# EAGLE design csa_sid_v1.0b (EAGLE 6.4)

## Sheet 1 of 3
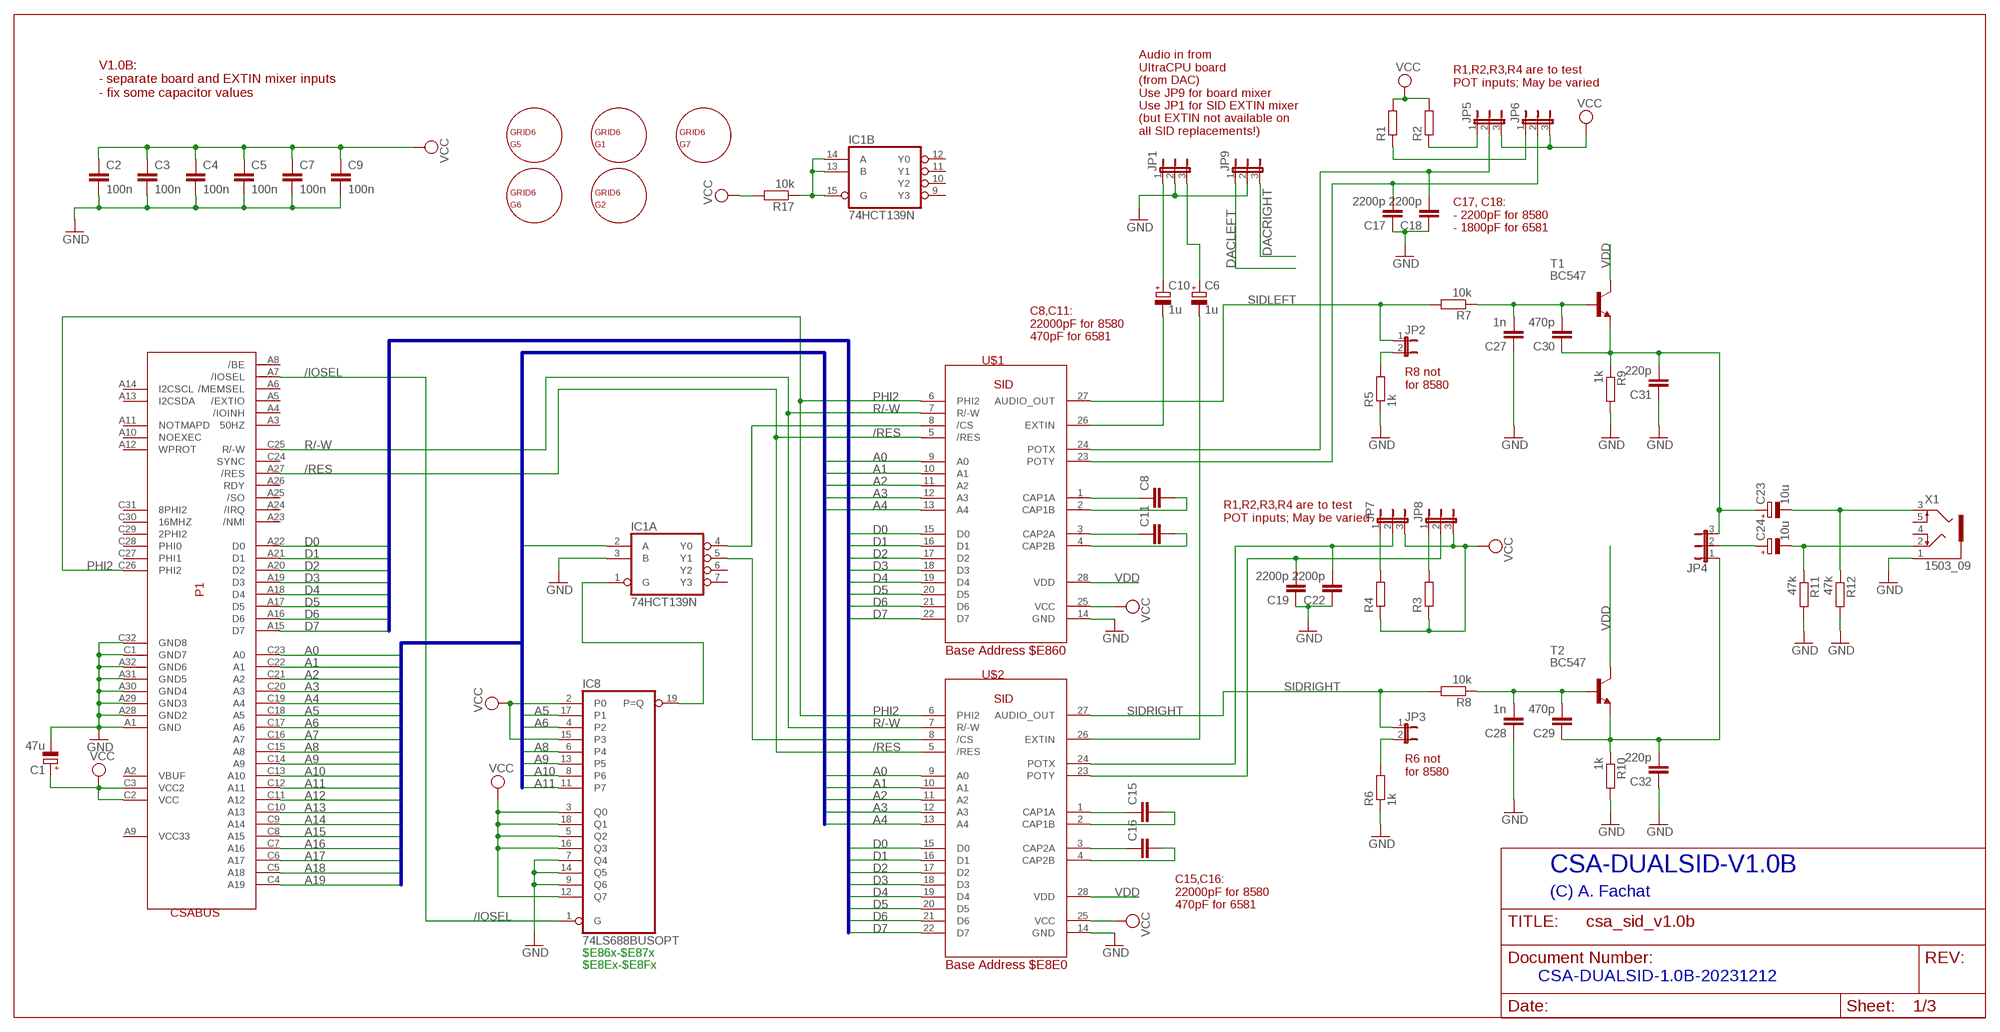
[diagram p0: schematic, sheet 1]

### Parts
C1  47u  CPOL-EUE2.5-7  [E2,5-7]
C2  100n  C-EU025-025X050  [C025-025X050]
C3  100n  C-EU025-025X050  [C025-025X050]
C4  100n  C-EU025-025X050  [C025-025X050]
C5  100n  C-EU025-025X050  [C025-025X050]
C6  1u  CPOL-EUE2-5  [E2-5]
C7  100n  C-EU025-025X050  [C025-025X050]
C8  C-EU025-025X050  [C025-025X050]
C9  100n  C-EU025-025X050  [C025-025X050]
C10  1u  CPOL-EUE2-5  [E2-5]
C11  C-EU025-025X050  [C025-025X050]
C15  C-EU025-025X050  [C025-025X050]
C16  C-EU025-025X050  [C025-025X050]
C17  2200p  C-EU025-025X050  [C025-025X050]
C18  2200p  C-EU025-025X050  [C025-025X050]
C19  2200p  C-EU025-025X050  [C025-025X050]
C22  2200p  C-EU025-025X050  [C025-025X050]
C23  10u  CPOL-EUE2-5  [E2-5]
C24  10u  CPOL-EUE2-5  [E2-5]
C27  1n  C-EU025-025X050  [C025-025X050]
C28  1n  C-EU025-025X050  [C025-025X050]
C29  470p  C-EU025-025X050  [C025-025X050]
C30  470p  C-EU025-025X050  [C025-025X050]
C31  220p  C-EU025-025X050  [C025-025X050]
C32  220p  C-EU025-025X050  [C025-025X050]
G1  GRID6  [GRID6]
G2  GRID6  [GRID6]
G5  GRID6  [GRID6]
G6  GRID6  [GRID6]
G7  GRID6  [GRID6]
IC1  74HCT139N  [DIL16]
IC8  74LS688BUSOPT  [DIL20]
JP1  JP2E  [JP2]
JP2  JP1E  [JP1]
JP3  JP1E  [JP1]
JP4  JP2E  [JP2]
JP5  JP2E  [JP2]
JP6  JP2E  [JP2]
JP7  JP2E  [JP2]
JP8  JP2E  [JP2]
JP9  JP2E  [JP2]
P1  CSABUS  [CSABUS]
R1  R-EU_0204/7  [0204/7]
R2  R-EU_0204/7  [0204/7]
R3  R-EU_0204/7  [0204/7]
R4  R-EU_0204/7  [0204/7]
R5  1k  R-EU_0204/7  [0204/7]
R6  1k  R-EU_0204/7  [0204/7]
R7  10k  R-EU_0204/7  [0204/7]
R8  10k  R-EU_0204/7  [0204/7]
R9  1k  R-EU_0204/7  [0204/7]
R10  1k  R-EU_0204/7  [0204/7]
R11  47k  R-EU_0204/7  [0204/7]
R12  47k  R-EU_0204/7  [0204/7]
R17  10k  R-EU_0204/7  [0204/7]
T1  BC547  [TO92]
T2  BC547  [TO92]
U$1  SID  [DIL28]
U$2  SID  [DIL28]
X1  1503_09  [1503_09]

### Nets
/IOSEL: IC8.1(G) P1.A7(/IOSEL)
/RES: P1.A27(/RES) U$1.5(/RES) U$2.5(/RES)
A0: P1.C23(A0) U$1.9(A0) U$2.9(A0)
A1: P1.C22(A1) U$1.10(A1) U$2.10(A1)
A2: P1.C21(A2) U$1.11(A2) U$2.11(A2)
A3: P1.C20(A3) U$1.12(A3) U$2.12(A3)
A4: P1.C19(A4) U$1.13(A4) U$2.13(A4)
A5: IC8.17(P1) P1.C18(A5)
A6: IC8.4(P2) P1.C17(A6)
A7: IC1.2(A:A) P1.C16(A7)
A8: IC8.6(P4) P1.C15(A8)
A9: IC8.13(P5) P1.C14(A9)
A10: IC8.8(P6) P1.C13(A10)
A11: IC8.11(P7) P1.C12(A11)
A12: P1.C11(A12)
A13: P1.C10(A13)
A14: P1.C9(A14)
A15: P1.C8(A15)
A16: P1.C7(A16)
A17: P1.C6(A17)
A18: P1.C5(A18)
A19: P1.C4(A19)
D0: P1.A22(D0) U$1.15(D0) U$2.15(D0)
D1: P1.A21(D1) U$1.16(D1) U$2.16(D1)
D2: P1.A20(D2) U$1.17(D2) U$2.17(D2)
D3: P1.A19(D3) U$1.18(D3) U$2.18(D3)
D4: P1.A18(D4) U$1.19(D4) U$2.19(D4)
D5: P1.A17(D5) U$1.20(D5) U$2.20(D5)
D6: P1.A16(D6) U$1.21(D6) U$2.21(D6)
D7: P1.A15(D7) U$1.22(D7) U$2.22(D7)
DACLEFT: JP9.1 ; also sheet 3
DACRIGHT: JP9.3 ; also sheet 3
GND: C1.- C2.2 C3.2 C4.2 C5.2 C7.2 C9.2 C17.1 C18.1 C19.1 C22.1 C27.1 C28.1 C31.1 C32.1 IC1.3(A:B) IC8.7(Q4) IC8.9(Q6) IC8.14(Q5) JP1.2 JP9.2 P1.A1(GND) P1.A28(GND2) P1.A29(GND3) P1.A30(GND4) P1.A31(GND5) P1.A32(GND6) P1.C1(GND7) P1.C32(GND8) R5.1 R6.1 R9.2 R10.2 R11.2 R12.2 U$1.14(GND) U$2.14(GND) X1.1 ; also sheet 2,3
N$1: IC1.1(A:G) IC8.19(P=Q)
N$2: IC1.4(A:Y0) U$1.8(/CS)
N$3: IC1.5(A:Y1) U$2.8(/CS)
N$4: C8.1 U$1.1(CAP1A)
N$5: C11.1 U$1.3(CAP2A)
N$6: C8.2 U$1.2(CAP1B)
N$7: C11.2 U$1.4(CAP2B)
N$8: C15.1 U$2.1(CAP1A)
N$9: C16.1 U$2.3(CAP2A)
N$10: C15.2 U$2.2(CAP1B)
N$11: C16.2 U$2.4(CAP2B)
N$12: C17.2 JP6.2 U$1.23(POTY)
N$13: C18.2 JP5.2 U$1.24(POTX)
N$14: C19.2 JP8.2 U$2.23(POTY)
N$15: C22.2 JP7.2 U$2.24(POTX)
N$16: C10.- U$1.26(EXTIN)
N$17: JP5.1 R2.1
N$18: JP6.1 R1.1
N$19: JP3.2 R6.2
N$20: JP2.2 R5.2
N$21: C6.- U$2.26(EXTIN)
N$22: C23.- R12.1 X1.3
N$23: C24.- R11.1 X1.2
N$24: C29.1 C32.2 JP4.1 R10.1 T2.1(E)
N$25: C23.+ C30.1 C31.2 JP4.3 R9.1 T1.1(E)
N$26: C27.2 C30.2 R7.1 T1.2(B)
N$28: C28.2 C29.2 R8.1 T2.2(B)
N$30: C24.+ JP4.2
N$35: IC1.13(B:B) IC1.14(B:A) IC1.15(B:G) R17.1
N$36: JP7.1 R4.2
N$37: JP8.1 R3.2
N$38: C6.+ JP1.3
N$39: C10.+ JP1.1
PHI2: P1.C26(PHI2) U$1.6(PHI2) U$2.6(PHI2)
R/-W: P1.C25(R/-W) U$1.7(R/-W) U$2.7(R/-W)
SIDLEFT: JP2.1 R7.2 U$1.27(AUDIO_OUT) ; also sheet 3
SIDRIGHT: JP3.1 R8.2 U$2.27(AUDIO_OUT) ; also sheet 3
VCC: C1.+ C2.1 C3.1 C4.1 C5.1 C7.1 C9.1 IC8.2(P0) IC8.3(Q0) IC8.5(Q2) IC8.12(Q7) IC8.15(P3) IC8.16(Q3) IC8.18(Q1) JP5.3 JP6.3 JP7.3 JP8.3 P1.C2(VCC) P1.C3(VCC2) R1.2 R2.2 R3.1 R4.1 R17.2 U$1.25(VCC) U$2.25(VCC) ; also sheet 2,3
VDD: T1.3(C) T2.3(C) U$1.28(VDD) U$2.28(VDD) ; also sheet 2
Unconnected: IC1.6(A:Y2) IC1.7(A:Y3) IC1.9(B:Y3) IC1.10(B:Y2) IC1.11(B:Y1) IC1.12(B:Y0) P1.A2(VBUF) P1.A3(50HZ) P1.A4(/IOINH) P1.A5(/EXTIO) P1.A6(/MEMSEL) P1.A8(/BE) P1.A9(VCC33) P1.A10(NOEXEC) P1.A11(NOTMAPD) P1.A12(WPROT) P1.A13(I2CSDA) P1.A14(I2CSCL) P1.A23(/NMI) P1.A24(/IRQ) P1.A25(/SO) P1.A26(RDY) P1.C24(SYNC) P1.C27(PHI1) P1.C28(PHI0) P1.C29(2PHI2) P1.C30(16MHZ) P1.C31(8PHI2) X1.4 X1.5

### Buses
D[0..7]
A[0..19]

### Notes on the sheet
- R1,R2,R3,R4 are to test
  POT inputs; May be varied
- V1.0B:
  - separate board and EXTIN mixer inputs
  - fix some capacitor values
- Audio in from
  UltraCPU board
  (from DAC)
  Use JP9 for board mixer
  Use JP1 for SID EXTIN mixer
  (but EXTIN not available on
  all SID replacements!)
- C17, C18:
  - 2200pF for 8580
  - 1800pF for 6581
- C8,C11: 
  22000pF for 8580
  470pF for 6581
- R8 not 
  for 8580
- R1,R2,R3,R4 are to test
  POT inputs; May be varied
- Base Address $E860
- R6 not
  for 8580
- CSA-DUALSID-V1.0B
- (C) A. Fachat
- C15,C16: 
  22000pF for 8580
  470pF for 6581
- $E86x-$E87x
- $E8Ex-$E8Fx | Base Address $E8E0
- CSA-DUALSID-1.0B-20231212

## Sheet 2 of 3: Power
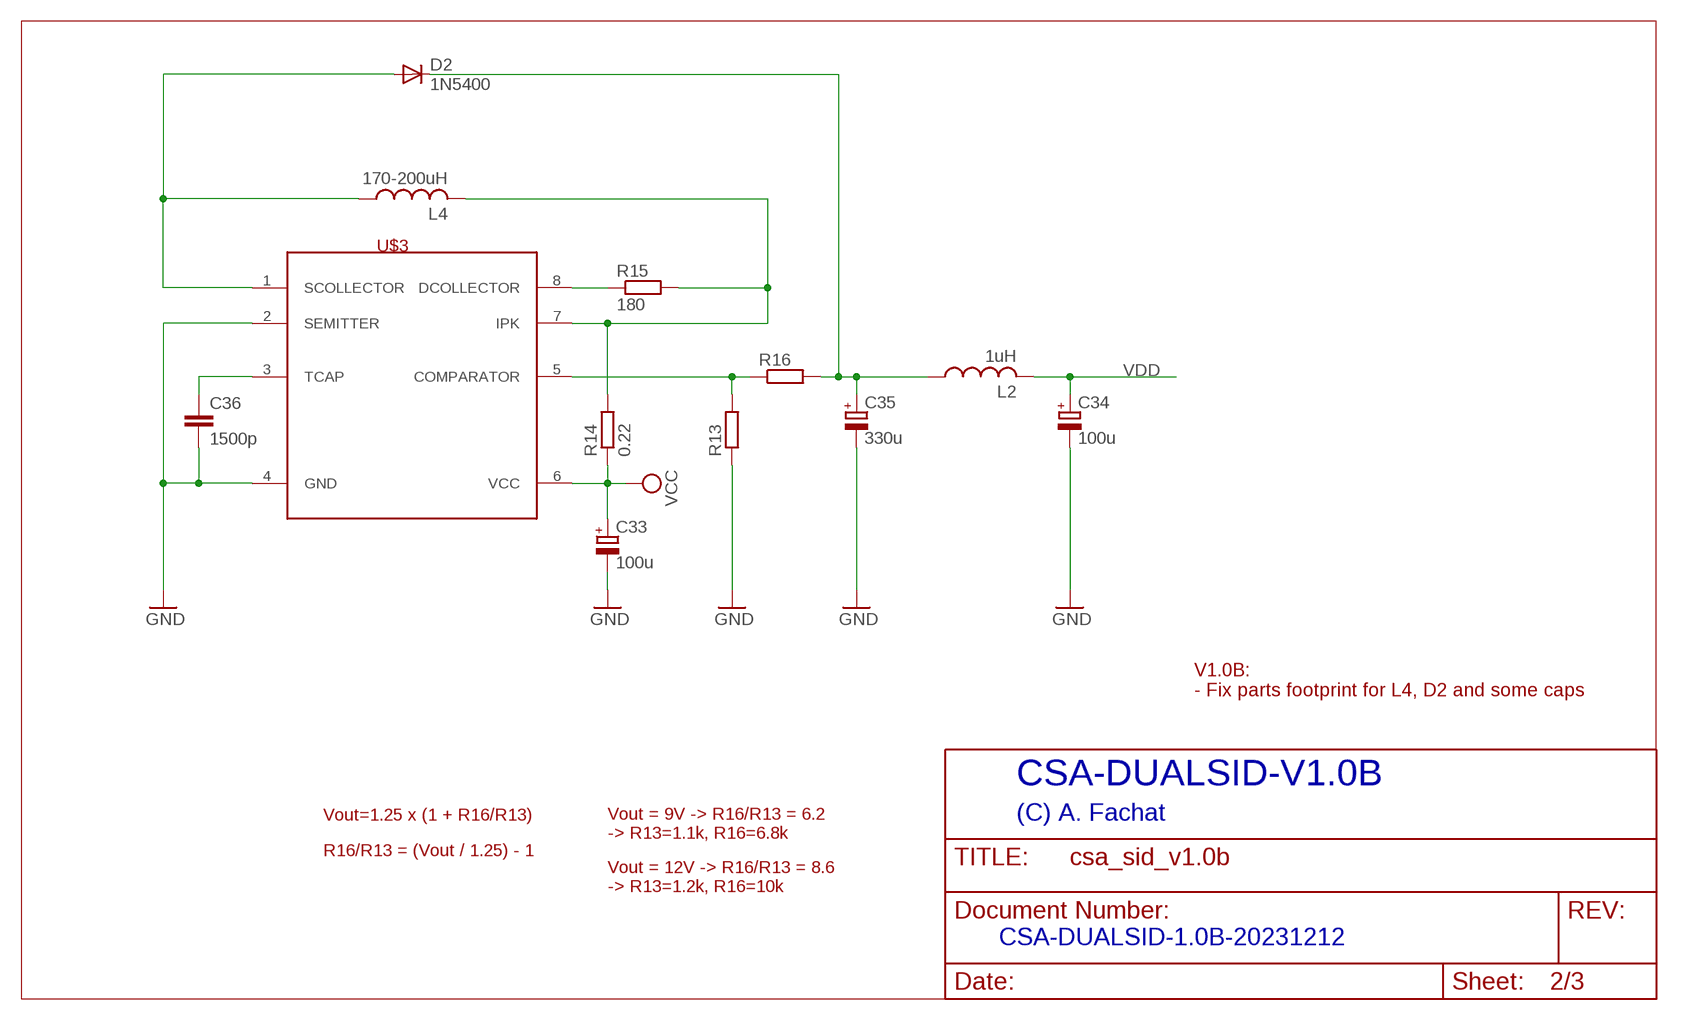
[diagram p1: schematic, sheet 2]

### Parts
C33  100u  CPOL-EUE2.5-7  [E2,5-7]
C34  100u  CPOL-EUE2.5-7  [E2,5-7]
C35  330u  CPOL-EUE2.5-7  [E2,5-7]
C36  1500p  C-EU025-024X044  [C025-024X044]
D2  1N5400  [DO201-15]
L2  1uH  L-US0204/7  [0204/7]
L4  170-200uH  L-USTJ4-U2  [TJ4-U2]
R13  R-EU_0204/7  [0204/7]
R14  0.22  R-EU_0204/7  [0204/7]
R15  180  R-EU_0204/7  [0204/7]
R16  R-EU_0204/7  [0204/7]
U$3  MC34063A  [DIL08]

### Nets
GND: C33.- C34.- C35.- C36.2 R13.1 U$3.2(SEMITTER) U$3.4(GND) ; also sheet 1,3
N$27: C36.1 U$3.3(TCAP)
N$29: R13.2 R16.1 U$3.5(COMPARATOR)
N$31: D2.A L4.1 U$3.1(SCOLLECTOR)
N$32: C35.+ D2.C L2.1 R16.2
N$33: L4.2 R14.2 R15.2 U$3.7(IPK)
N$34: R15.1 U$3.8(DCOLLECTOR)
VCC: C33.+ R14.1 U$3.6(VCC) ; also sheet 1,3
VDD: C34.+ L2.2 ; also sheet 1

### Notes on the sheet
- V1.0B:
  - Fix parts footprint for L4, D2 and some caps
- CSA-DUALSID-V1.0B
- Vout=1.25 x (1 + R16/R13) | (C) A. Fachat
- Vout = 9V -> R16/R13 = 6.2
  -> R13=1.1k, R16=6.8k
- R16/R13 = (Vout / 1.25) - 1
- Vout = 12V -> R16/R13 = 8.6
  -> R13=1.2k, R16=10k
- CSA-DUALSID-1.0B-20231212

## Sheet 3 of 3: Mixer
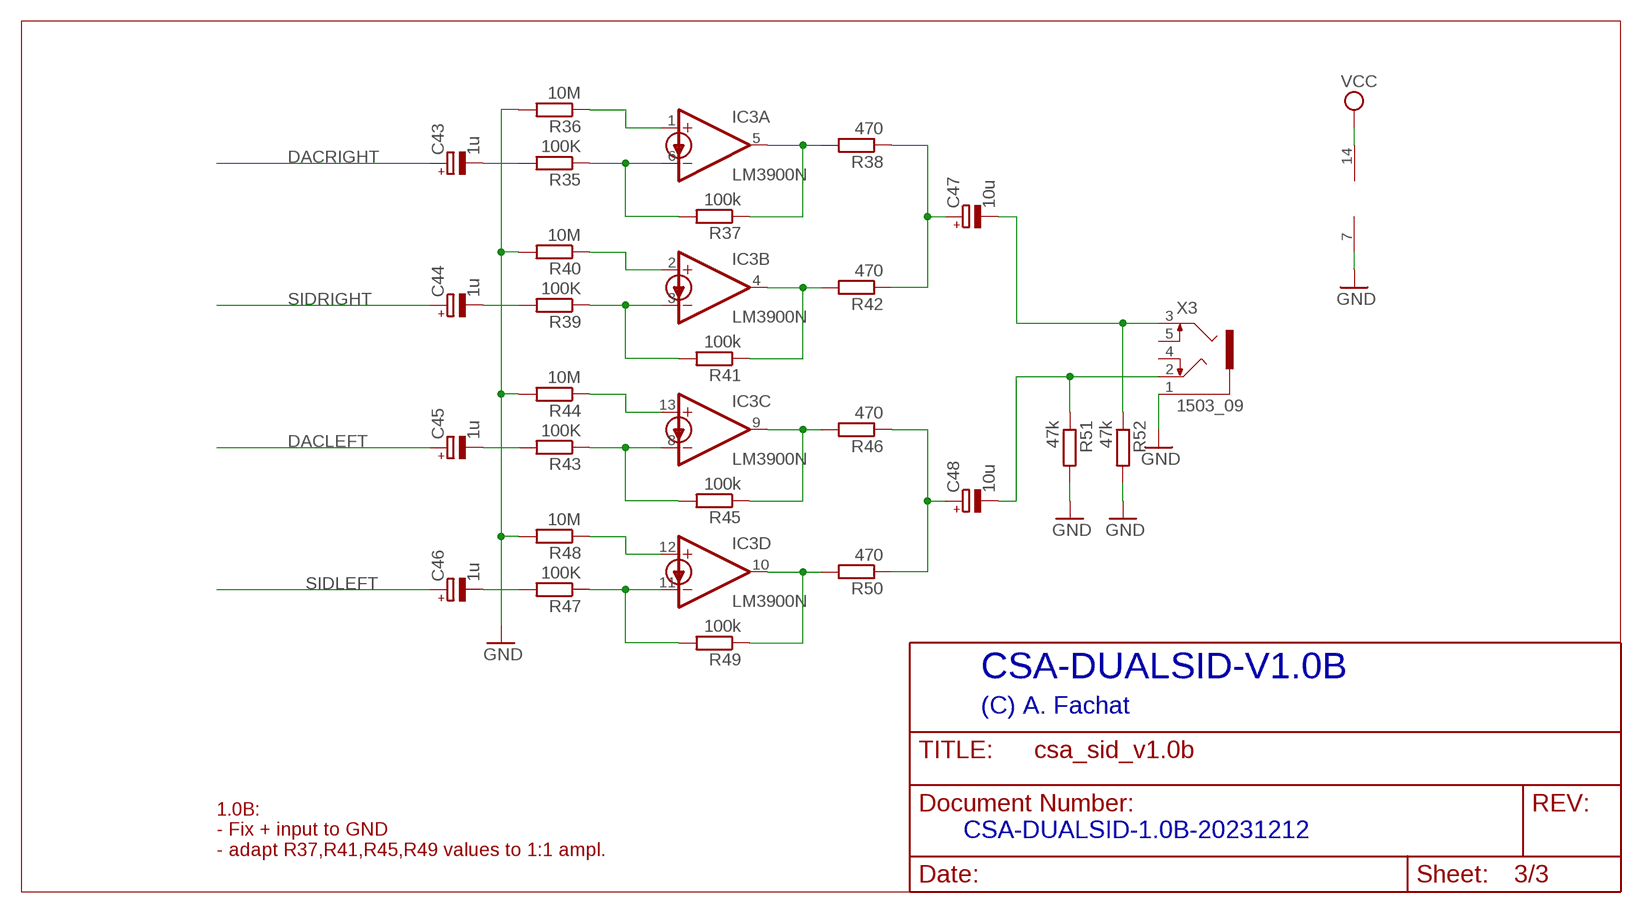
[diagram p2: schematic, sheet 3]

### Parts
C43  1u  CPOL-EUE2-5  [E2-5]
C44  1u  CPOL-EUE2-5  [E2-5]
C45  1u  CPOL-EUE2-5  [E2-5]
C46  1u  CPOL-EUE2-5  [E2-5]
C47  10u  CPOL-EUE2-5  [E2-5]
C48  10u  CPOL-EUE2-5  [E2-5]
IC3  LM3900N  [DIL14]
R35  100K  R-EU_0204/7  [0204/7]
R36  10M  R-EU_0204/7  [0204/7]
R37  100k  R-EU_0204/7  [0204/7]
R38  470  R-EU_0204/7  [0204/7]
R39  100K  R-EU_0204/7  [0204/7]
R40  10M  R-EU_0204/7  [0204/7]
R41  100k  R-EU_0204/7  [0204/7]
R42  470  R-EU_0204/7  [0204/7]
R43  100K  R-EU_0204/7  [0204/7]
R44  10M  R-EU_0204/7  [0204/7]
R45  100k  R-EU_0204/7  [0204/7]
R46  470  R-EU_0204/7  [0204/7]
R47  100K  R-EU_0204/7  [0204/7]
R48  10M  R-EU_0204/7  [0204/7]
R49  100k  R-EU_0204/7  [0204/7]
R50  470  R-EU_0204/7  [0204/7]
R51  47k  R-EU_0204/7  [0204/7]
R52  47k  R-EU_0204/7  [0204/7]
X3  1503_09  [1503_09]

### Nets
DACLEFT: C45.+ ; also sheet 1
DACRIGHT: C43.+ ; also sheet 1
GND: IC3.7(P:GND) R36.2 R40.2 R44.2 R48.2 R51.2 R52.2 X3.1 ; also sheet 1,2
N$57: IC3.1(A:+IN) R36.1
N$58: C43.- R35.2
N$59: IC3.6(A:-IN) R35.1 R37.2
N$60: IC3.5(A:OUT) R37.1 R38.2
N$61: IC3.2(B:+IN) R40.1
N$62: C44.- R39.2
N$63: IC3.3(B:-IN) R39.1 R41.2
N$64: IC3.4(B:OUT) R41.1 R42.2
N$65: IC3.13(C:+IN) R44.1
N$66: C45.- R43.2
N$67: IC3.8(C:-IN) R43.1 R45.2
N$68: IC3.9(C:OUT) R45.1 R46.2
N$69: IC3.12(D:+IN) R48.1
N$70: C46.- R47.2
N$71: IC3.11(D:-IN) R47.1 R49.2
N$72: IC3.10(D:OUT) R49.1 R50.2
N$73: C47.+ R38.1 R42.1
N$74: C47.- R52.1 X3.3
N$75: C48.+ R46.1 R50.1
N$76: C48.- R51.1 X3.2
SIDLEFT: C46.+ ; also sheet 1
SIDRIGHT: C44.+ ; also sheet 1
VCC: IC3.14(P:V+) ; also sheet 1,2
Unconnected: X3.4 X3.5

### Notes on the sheet
- CSA-DUALSID-V1.0B
- (C) A. Fachat
- CSA-DUALSID-1.0B-20231212
- 1.0B:
  - Fix + input to GND
  - adapt R37,R41,R45,R49 values to 1:1 ampl.

## Power pins joined to a net without a drawn wire
GND: IC1.8(P:GND) IC8.10(GND)
VCC: IC1.16(P:VCC) IC8.20(VCC)

## Library data of the parts
C1 C6 C10 C23 C24 C33-C35 C43-C48 = rcl:CPOL-EU: POLARIZED CAPACITOR, European symbol
C2-C5 C7-C9 C11 C15-C19 C22 C27-C32 C36 = rcl:C-EU: CAPACITOR, European symbol
D2 = diode:1N5400: DIODE standard rectifier, 3 A, 50 V (Motorola)
G1 G2 G5-G7 = csa:GRID
IC1 = 74xx-eu:74*139: Dual 2-line to 4-line DECODER/DEMULTIPLEXER
IC3 = linear:LM3900: OP AMP
IC8 = csa:74LS688BUSOPT
JP1 JP4-JP9 = jumper:JP2E: JUMPER
JP2 JP3 = jumper:JP1E: JUMPER
L2 L4 = rcl:L-US: INDUCTOR, American symbol
P1 = csa:CSABUS
R1-R17 R35-R52 = rcl:R-EU_: RESISTOR, European symbol
T1 T2 = transistor:BC547: NPN TRANSISTOR
U$1 U$2 = csa:SID
U$3 = csa:MC34063A
X1 X3 = con-lumberg:1503_09: Jack connectors according to JISC 6560, 3.5 mm Klinkeneinbaukupplung nach JISC 6560, 3,5 mm, 3-polig/ stereo, abgewinkelte Ausführung, mit 2 Öffnern und Lötaugen, für Leiterplatten Rückseitenmontage Source: http://www.lumberg.com/Produkte/PDFs/1503_09.pdf; OC_FARNELL: 1243244; OC_NEWARK: unknown

## Board
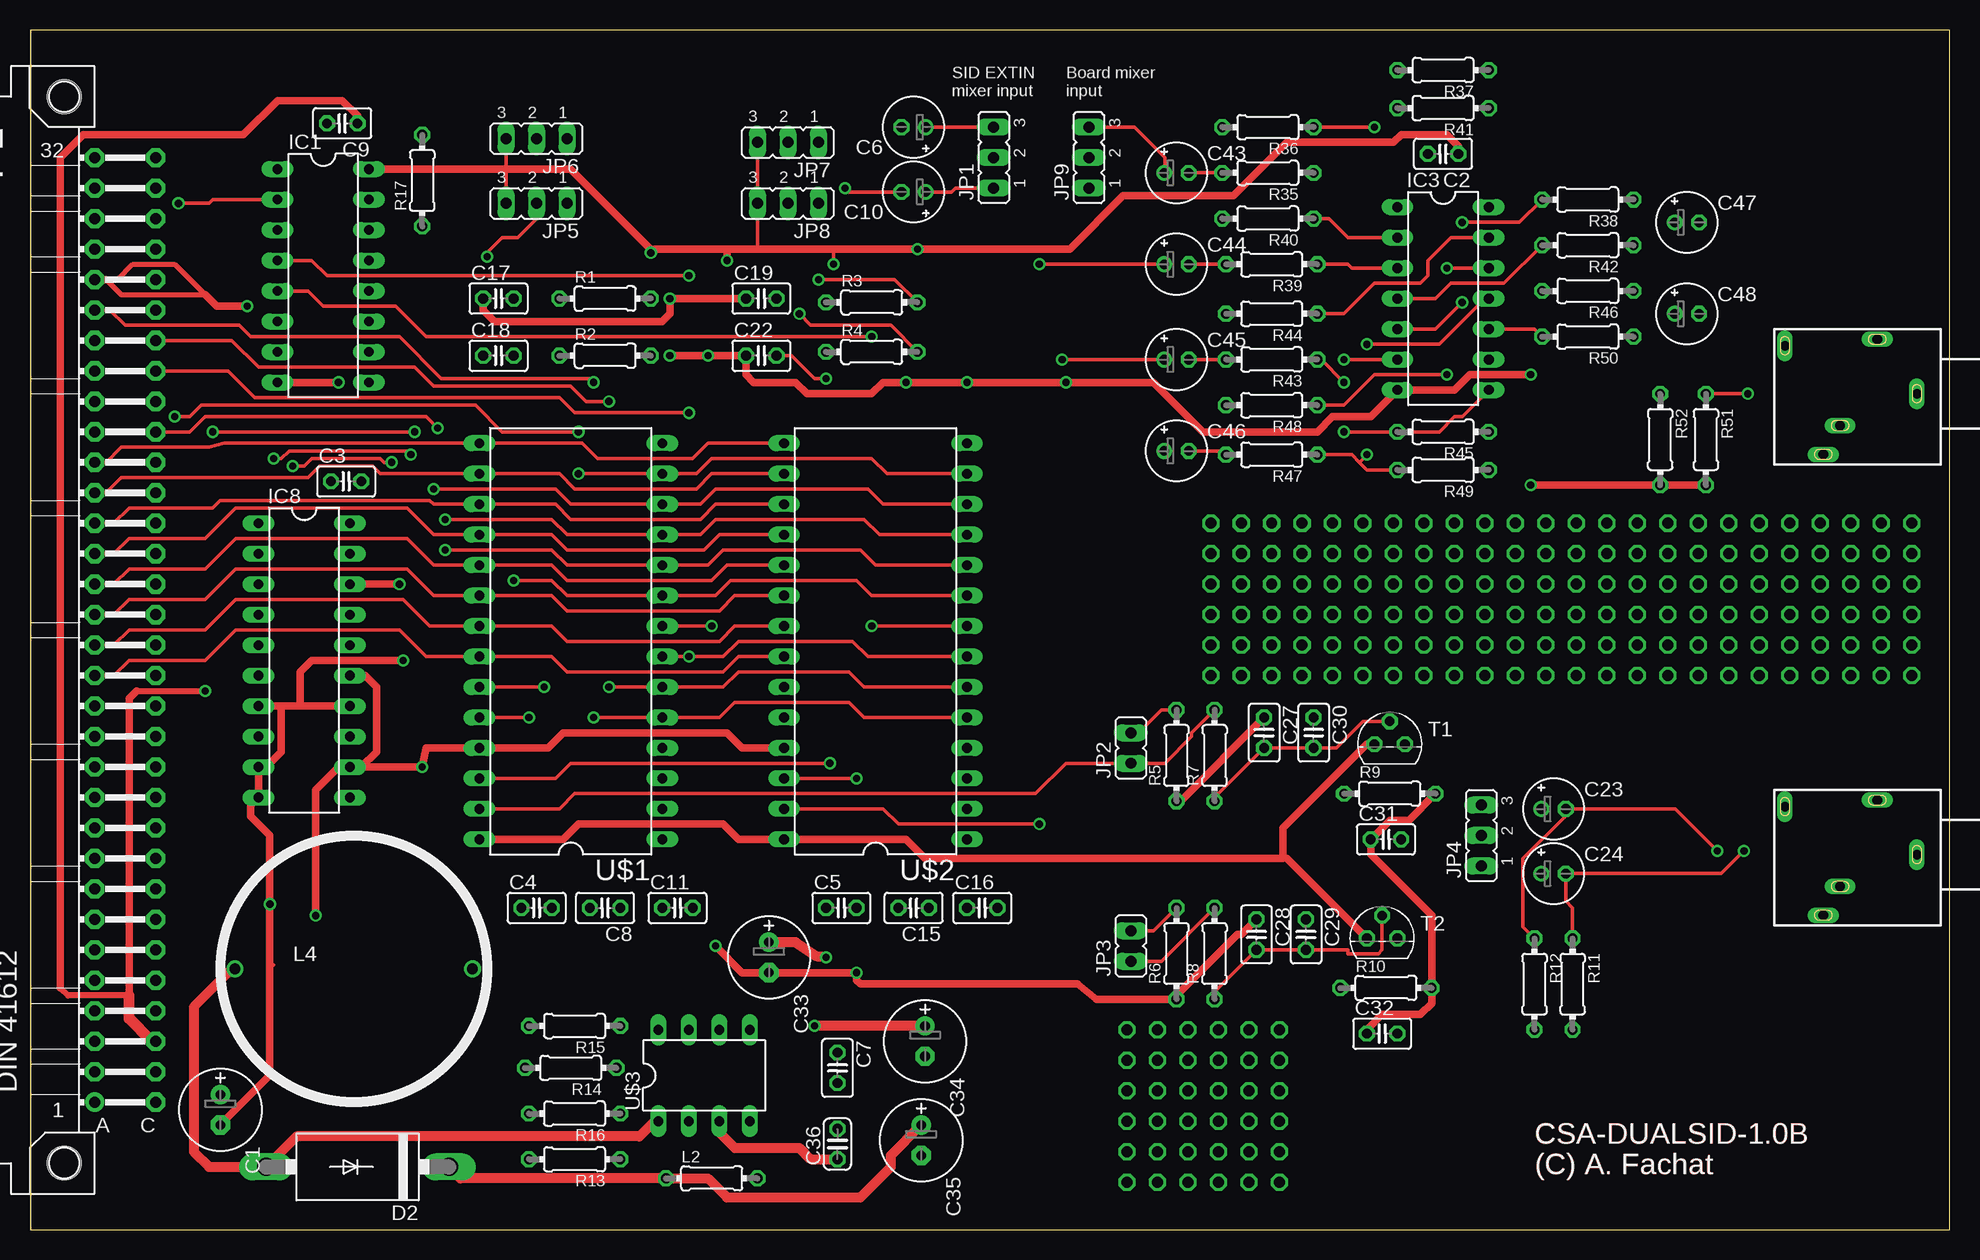
[diagram p3: board, top side]
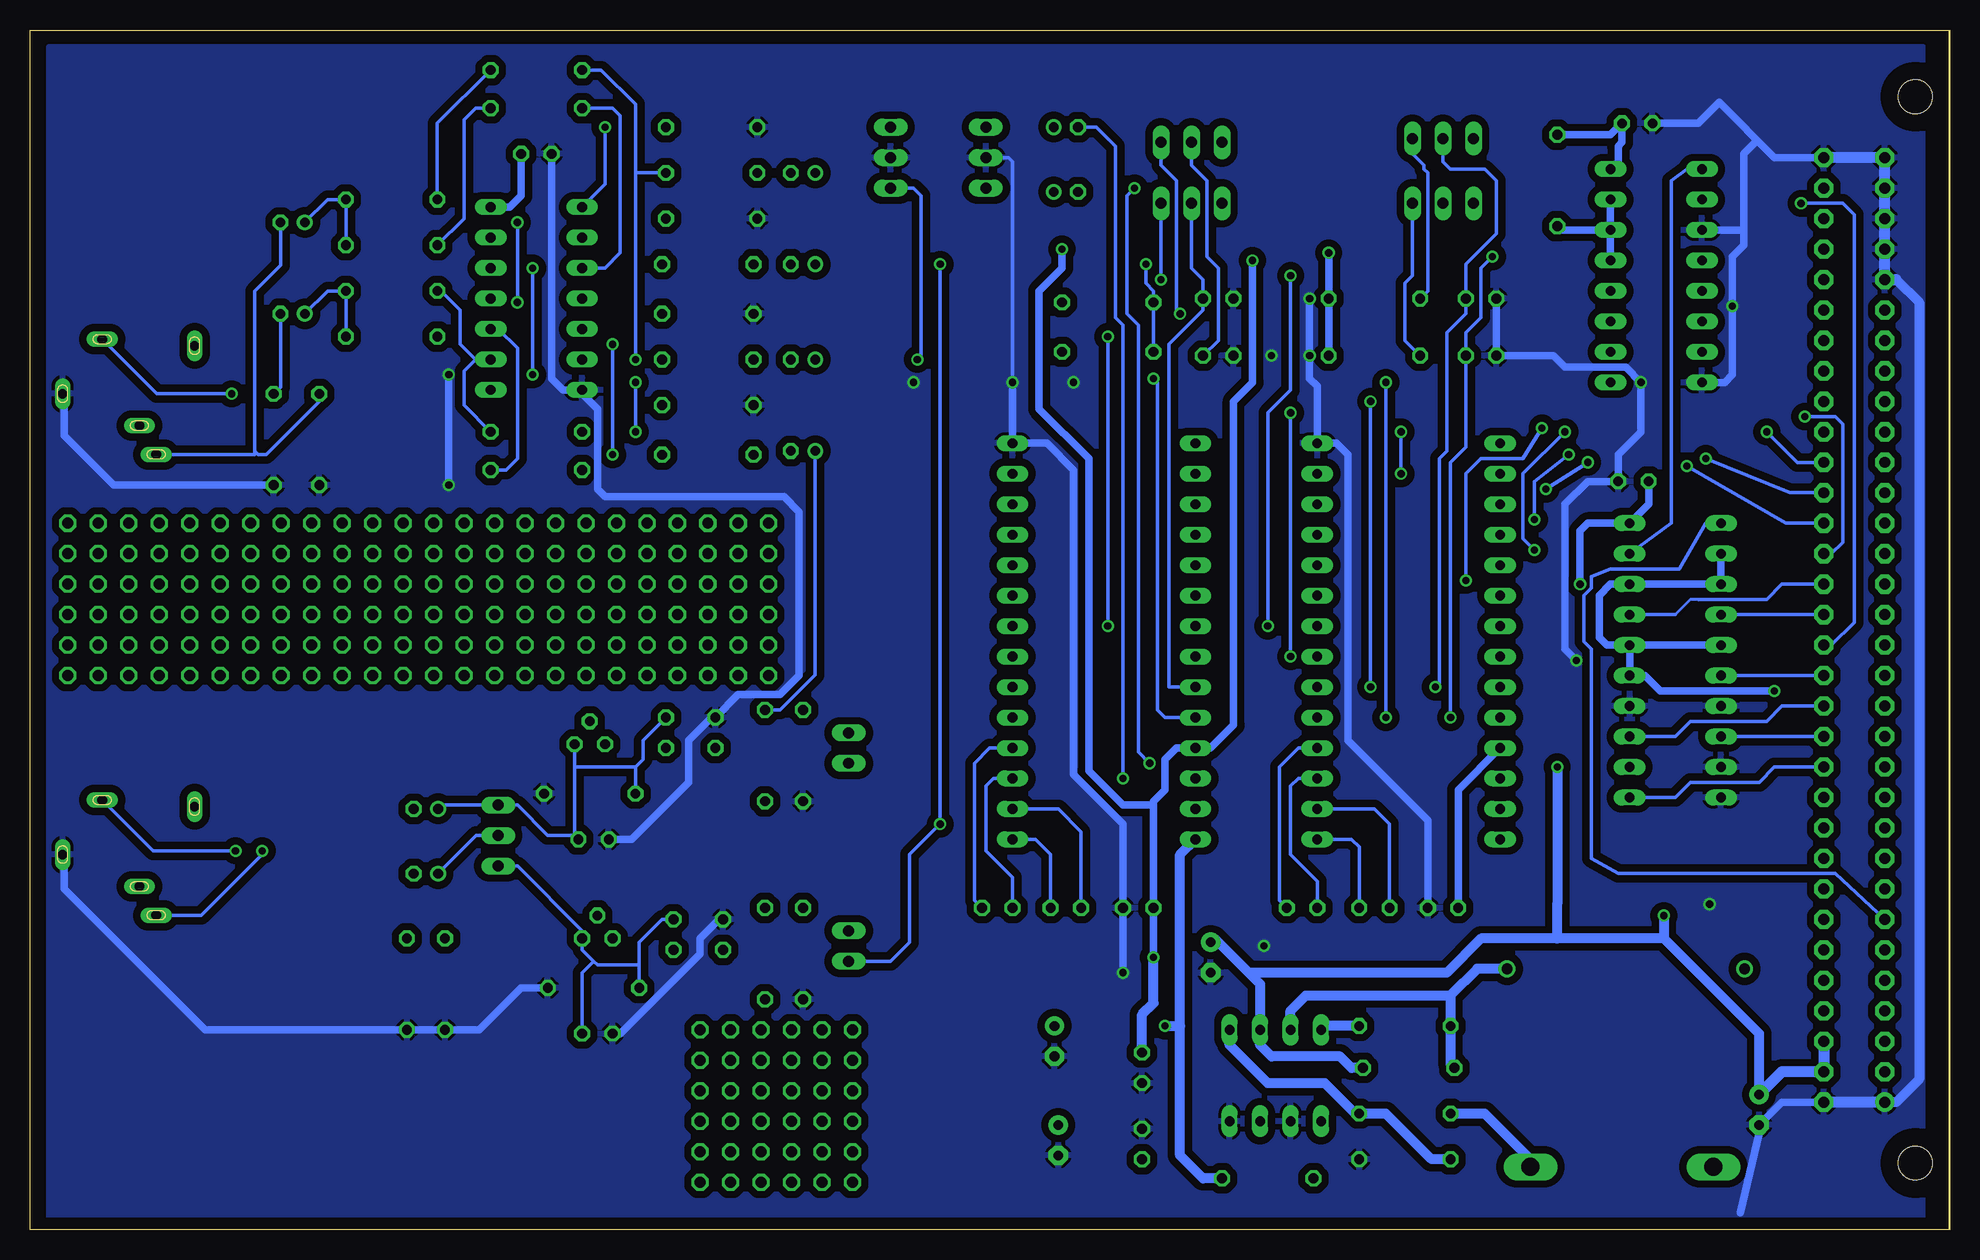
[diagram p4: board, bottom side, seen from below]

Size 160 x 100.03 mm. Coordinates in mm from the lower left corner, seen from the top.
Outline: 0,0.01 160,0.01 160,100.01 0,100.01 0,0.01
Copper layers (1*16): Top 0.035mm / dielectric 1.5mm / Bottom 0.035mm
Design rules "default *": minimum track width 10mil, minimum drill 12mil, track to track 8mil, track to pad 8mil, pad to pad 8mil, via to via 8mil, smd to smd 8mil, copper to edge 40mil, drill to drill 8mil, minimum pad ring 10mil, minimum via ring 8mil, stop-mask expansion 4mil, vias tented up to drill 0mil, thermal gap 10mil

### Footprints (pad centres in the part's own frame; a part is rotated, then mirrored left to right if it is on the bottom)
E2,5-7 = drill 0.813 pad 1.6: + -1.27,0 | drill 0.813 pad 1.6 octagon: - 1.27,0
C025-025X050 = drill 0.813 octagon: 1 -1.27,0; 2 1.27,0
E2-5 = drill 0.813 pad 1.27: + -1.016,0 | drill 0.813 pad 1.27 octagon: - 1.016,0
C025-024X044 = drill 0.813 octagon: 1 -1.27,0; 2 1.27,0
DO201-15 = drill 1.499 long: A 7.62,0; C -7.62,0
GRID6 = drill 0.914 octagon: 1 -6.35,-1.27; 2 -3.81,-1.27; 3 -1.27,-1.27; 4 1.27,-1.27; 5 3.81,-1.27; 6 6.35,-1.27; 7 -6.35,3.81; 8 -3.81,3.81; 9 -1.27,3.81; 10 1.27,3.81; 11 3.81,3.81; 12 6.35,3.81; 13 -6.35,-6.35; 14 -3.81,-6.35; 15 -1.27,-6.35; 16 1.27,-6.35; 17 3.81,-6.35; 18 6.35,-6.35; A -6.35,1.27; A1 -6.35,6.35; A2 -6.35,-3.81; B -3.81,1.27; B1 -3.81,6.35; B2 -3.81,-3.81; C -1.27,1.27; C1 -1.27,6.35; C2 -1.27,-3.81; D 1.27,1.27; D1 1.27,6.35; D2 1.27,-3.81; E 3.81,1.27; E1 3.81,6.35; E2 3.81,-3.81; F 6.35,1.27; F1 6.35,6.35; F2 6.35,-3.81
DIL16 = drill 0.813 long: 1 -8.89,-3.81; 2 -6.35,-3.81; 3 -3.81,-3.81; 4 -1.27,-3.81; 5 1.27,-3.81; 6 3.81,-3.81; 7 6.35,-3.81; 8 8.89,-3.81; 9 8.89,3.81; 10 6.35,3.81; 11 3.81,3.81; 12 1.27,3.81; 13 -1.27,3.81; 14 -3.81,3.81; 15 -6.35,3.81; 16 -8.89,3.81
DIL14 = drill 0.813 long: 1 -7.62,-3.81; 2 -5.08,-3.81; 3 -2.54,-3.81; 4 0,-3.81; 5 2.54,-3.81; 6 5.08,-3.81; 7 7.62,-3.81; 8 7.62,3.81; 9 5.08,3.81; 10 2.54,3.81; 11 0,3.81; 12 -2.54,3.81; 13 -5.08,3.81; 14 -7.62,3.81
DIL20 = drill 0.813 long: 1 -10.16,-3.81; 2 -7.62,-3.81; 3 -5.08,-3.81; 4 -2.54,-3.81; 5 0,-3.81; 6 2.54,-3.81; 7 5.08,-3.81; 8 7.62,-3.81; 9 10.16,-3.81; 10 12.7,-3.81; 11 12.7,3.81; 12 10.16,3.81; 13 7.62,3.81; 14 5.08,3.81; 15 2.54,3.81; 16 0,3.81; 17 -2.54,3.81; 18 -5.08,3.81; 19 -7.62,3.81; 20 -10.16,3.81
JP2 = drill 0.914 long: 1 -2.54,0; 2 0,0; 3 2.54,0
JP1 = drill 0.914 long: 1 0,-1.27; 2 0,1.27
0204/7 = drill 0.813 octagon: 1 -3.81,0; 2 3.81,0
TJ4-U2 = drill 0.9: 1 -9.9,0; 2 9.9,0
CSABUS = drill 0.914 pad 1.6: A1 7.62,36.83 | drill 0.914 pad 1.6 octagon: A2 7.62,34.29; A3 7.62,31.75; A4 7.62,29.21; A5 7.62,26.67; A6 7.62,24.13; A7 7.62,21.59; A8 7.62,19.05; A9 7.62,16.51; A10 7.62,13.97; A11 7.62,11.43; A12 7.62,8.89; A13 7.62,6.35; A14 7.62,3.81; A15 7.62,1.27; A16 7.62,-1.27; A17 7.62,-3.81; A18 7.62,-6.35; A19 7.62,-8.89; A20 7.62,-11.43; A21 7.62,-13.97; A22 7.62,-16.51; A23 7.62,-19.05; A24 7.62,-21.59; A25 7.62,-24.13; A26 7.62,-26.67; A27 7.62,-29.21; A28 7.62,-31.75; A29 7.62,-34.29; A30 7.62,-36.83; A31 7.62,-39.37; A32 7.62,-41.91; C1 2.54,36.83; C2 2.54,34.29; C3 2.54,31.75; C4 2.54,29.21; C5 2.54,26.67; C6 2.54,24.13; C7 2.54,21.59; C8 2.54,19.05; C9 2.54,16.51; C10 2.54,13.97; C11 2.54,11.43; C12 2.54,8.89; C13 2.54,6.35; C14 2.54,3.81; C15 2.54,1.27; C16 2.54,-1.27; C17 2.54,-3.81; C18 2.54,-6.35; C19 2.54,-8.89; C20 2.54,-11.43; C21 2.54,-13.97; C22 2.54,-16.51; C23 2.54,-19.05; C24 2.54,-21.59; C25 2.54,-24.13; C26 2.54,-26.67; C27 2.54,-29.21; C28 2.54,-31.75; C29 2.54,-34.29; C30 2.54,-36.83; C31 2.54,-39.37; C32 2.54,-41.91 | hole 2.794: 10.16,41.91; 10.16,-46.99
TO92 = drill 0.813 octagon: 1 1.27,0; 2 0,1.905; 3 -1.27,0
DIL28 = drill 0.813 long: 1 -13.97,-7.62; 2 -11.43,-7.62; 3 -8.89,-7.62; 4 -6.35,-7.62; 5 -3.81,-7.62; 6 -1.27,-7.62; 7 1.27,-7.62; 8 3.81,-7.62; 9 6.35,-7.62; 10 8.89,-7.62; 11 11.43,-7.62; 12 13.97,-7.62; 13 16.51,-7.62; 14 19.05,-7.62; 15 19.05,7.62; 16 16.51,7.62; 17 13.97,7.62; 18 11.43,7.62; 19 8.89,7.62; 20 6.35,7.62; 21 3.81,7.62; 22 1.27,7.62; 23 -1.27,7.62; 24 -3.81,7.62; 25 -6.35,7.62; 26 -8.89,7.62; 27 -11.43,7.62; 28 -13.97,7.62
DIL08 = drill 0.813 long: 1 -11.43,-2.54; 2 -8.89,-2.54; 3 -6.35,-2.54; 4 -3.81,-2.54; 5 -3.81,5.08; 6 -6.35,5.08; 7 -8.89,5.08; 8 -11.43,5.08
1503_09 = drill 0.8 pad 1.2 long: 1 0,-2.1; 2 -4.55,-5.4; 3 5.05,-9.9; 4 -4,-13.1; 5 2.65,-8.5

### Placement (x,y rotation side)
C1  15.87,10.01 270 top
C2  117.79,89.7 180 top
C3  26.35,62.4 0 top
C4  42.22,26.84 0 top
C5  67.62,26.84 0 top
C6  73.66,91.92 180 top
C7  67.3,13.5 270 top
C8  47.94,26.84 180 top
C9  26.03,92.24 180 top
C10  73.66,86.53 180 top
C11  53.97,26.84 0 top
C15  73.66,26.84 180 top
C16  79.37,26.84 0 top
C17  39.05,77.64 0 top
C18  39.05,72.87 0 top
C19  60.96,77.64 0 top
C22  60.96,72.87 0 top
C23  126.99,35.09 0 top
C24  126.99,29.69 0 top
C27  102.86,41.44 270 top
C28  102.23,24.61 270 top
C29  106.36,24.61 270 top
C30  106.99,41.44 270 top
C31  113.02,32.55 0 top
C32  112.71,16.36 0 top
C33  61.59,22.71 270 top
C34  74.61,15.72 270 top
C35  74.29,7.47 270 top
C36  67.3,7.15 90 top
C43  95.56,88.11 0 top
C44  95.56,80.49 0 top
C45  95.56,72.56 0 top
C46  95.56,64.94 0 top
C47  138.11,83.99 0 top
C48  138.11,76.37 0 top
D2  27.3,5.25 180 top
G1  150.49,52.55 0 top
G2  135.25,52.55 0 top
G5  120.01,52.55 0 top
G6  104.77,52.55 0 top
G7  97.78,10.33 0 top
IC1  24.44,79.54 270 top
IC3  117.79,77.64 270 top
IC8  22.86,48.74 270 top
JP1  80.32,89.38 90 top
JP2  91.75,40.17 0 top
JP3  91.75,23.66 0 top
JP4  120.96,32.87 90 top
JP5  42.22,85.57 180 top
JP6  42.22,90.97 180 top
JP7  63.18,90.65 180 top
JP8  63.18,85.57 180 top
JP9  88.26,89.38 90 top
L2  56.83,4.29 0 top
L4  26.98,21.76 0 top
P1  13.01,47.47 180 top
R1  47.94,77.64 0 top
R2  47.94,72.87 0 top
R3  70.16,77.32 0 top
R4  70.16,73.19 0 top
R5  95.56,39.54 90 top
R6  95.56,23.03 90 top
R7  98.74,39.54 90 top
R8  98.74,23.03 90 top
R9  113.34,36.36 0 top
R10  113.02,20.17 0 top
R11  128.58,20.49 270 top
R12  125.41,20.49 270 top
R13  45.4,5.88 180 top
R14  45.08,13.5 180 top
R15  45.4,16.99 180 top
R16  45.4,9.69 180 top
R17  32.7,87.48 90 top
R35  103.18,88.11 180 top
R36  103.18,91.92 180 top
R37  117.79,96.69 180 top
R38  129.85,85.89 180 top
R39  103.5,80.49 180 top
R40  103.18,84.3 180 top
R41  117.79,93.51 180 top
R42  129.85,82.08 180 top
R43  103.5,72.56 180 top
R44  103.5,76.37 180 top
R45  117.79,66.52 180 top
R46  129.85,78.27 180 top
R47  103.5,64.62 180 top
R48  103.5,68.75 180 top
R49  117.79,63.35 180 top
R50  129.85,74.46 180 top
R51  139.69,65.89 270 top
R52  135.88,65.89 270 top
T1  113.34,40.49 0 top
T2  112.71,24.3 0 top
U$1  45.08,46.52 90 top
U$2  70.48,46.52 90 top
U$3  63.81,11.6 0 top
X1  159.38,31.28 270 top
X3  159.38,69.7 270 top

### Tracks (layer width: path | path; a pad name or v marks a point on that pad's centre or on a via)
/IOSEL
  Bottom 0.305: IC8.1 20.31,58.9 22.54,55.09 28.25,55.09 29.84,54.46 29.84,53.51 30.47,52.87 30.47,49.06 29.84,48.43 29.84,30.96 27.62,29.69 9.52,29.69 P1.A7
/RES  (via drill 0.6)
  Top 0.305: P1.A27 6.66,76.68 7.93,75.41 17.46,75.41 18.41,74.46 30.79,74.46 34.29,70.97 46.98,70.97 v46.98,70.65 | v46.98,42.71 U$1.5 57.46,42.71 58.73,43.98 68.26,43.98 69.53,42.71 U$2.5
  Bottom 0.305: v46.98,70.65 v46.98,42.71
A0  (via drill 0.6)
  Top 0.305: P1.C23 13.33,66.52 14.6,67.79 33.02,67.79 v33.97,66.84 | v40.32,54.14 43.49,54.14 44.76,52.87 U$1.9 57.15,52.87 58.41,54.14 68.89,54.14 70.16,52.87 U$2.9
  Bottom 0.305: v33.97,66.84 35.55,64.3 39.05,64.3 40.32,63.03 v40.32,54.14
A1  (via drill 0.6)
  Top 0.305: v15.24,66.52 v32.06,66.52 | v34.6,56.68 43.49,56.68 44.76,55.41 U$1.10 56.51,55.41 57.78,56.68 69.21,56.68 70.48,55.41 U$2.10
  Bottom 0.305: P1.C22 12.7,63.98 v15.24,66.52 | v32.06,66.52 35.55,63.03 35.55,57.63 v34.6,56.68
A2  (via drill 0.6)
  Top 0.305: v20.31,64.3 20.95,64.3 21.58,64.94 31.43,64.94 v31.74,64.62 | v34.6,59.22 43.49,59.22 44.76,57.95 U$1.11 55.88,57.95 57.15,59.22 69.53,59.22 70.8,57.95 U$2.11
  Bottom 0.305: P1.C21 13.33,61.44 v20.31,64.3 | v31.74,64.62 34.6,62.4 v34.6,59.22
A3  (via drill 0.6)
  Top 0.305: v21.9,63.66 22.86,63.66 23.49,64.3 29.2,64.3 29.52,63.98 v30.16,63.98 | v33.65,61.76 43.81,61.76 45.08,60.49 U$1.12 55.88,60.49 57.15,61.76 69.84,61.76 71.11,60.49 U$2.12
  Bottom 0.305: P1.C20 13.65,58.9 v21.9,63.66 | v30.16,63.98 v33.65,61.76
A4  (via drill 0.6)
  Top 0.305: v12.06,67.79 13.33,67.79 14.28,68.75 37.14,68.75 39.37,66.52 v45.72,66.52 | v45.72,63.03 U$1.13 55.56,63.03 56.83,64.3 70.16,64.3 71.43,63.03 U$2.13
  Bottom 0.305: P1.C19 9.84,56.36 8.89,57.32 8.89,67.16 9.52,67.79 v12.06,67.79 | v45.72,66.52 v45.72,63.03
A5
  Bottom 0.254: 20.95,52.55 21.58,52.55 22.86,51.28
  Bottom 0.305: P1.C18 13.97,53.82 15.24,52.55 20.95,52.55 | 22.86,51.28 IC8.17
A6
  Bottom 0.305: P1.C17 IC8.4
A7  (via drill 0.6)
  Top 0.305: v12.38,85.57 14.92,85.57 15.24,85.89 IC1.2
  Bottom 0.305: P1.C16 9.84,48.74 7.93,50.65 7.93,84.62 8.89,85.57 v12.38,85.57
A8
  Bottom 0.305: P1.C15 IC8.6
A9
  Bottom 0.305: P1.C14 13.97,43.66 15.24,42.39 21.58,42.39 22.86,41.12 IC8.13
A10
  Bottom 0.305: P1.C13 IC8.8
A11
  Bottom 0.305: P1.C12 14.6,38.58 15.87,37.31 21.58,37.31 22.86,36.04 IC8.11
D0
  Top 0.305: P1.A22 6.34,63.98 7.62,65.25 14.92,65.25 16.19,65.57 U$1.15 46.03,65.57 47.3,64.3 55.24,64.3 56.51,65.57 U$2.15
D1
  Top 0.305: P1.A21 6.34,61.44 7.62,62.71 23.17,62.71 24.12,63.66 28.57,63.66 29.2,63.03 U$1.16 44.13,63.03 45.4,61.76 55.56,61.76 56.83,63.03 U$2.16
D2
  Top 0.305: P1.A20 6.98,58.9 8.25,60.17 15.24,60.17 15.87,60.81 33.33,60.81 33.65,60.49 U$1.17 43.81,60.49 45.08,59.22 55.88,59.22 57.15,60.49 U$2.17
D3
  Top 0.305: P1.A19 6.98,56.36 8.25,57.63 14.6,57.63 17.14,60.17 31.43,60.17 33.65,57.95 U$1.18 43.49,57.95 44.76,56.68 56.19,56.68 57.46,57.95 U$2.18
D4
  Top 0.305: P1.A18 6.98,53.82 8.25,55.09 14.6,55.09 17.14,57.63 31.43,57.63 33.65,55.41 U$1.19 43.49,55.41 44.76,54.14 56.83,54.14 58.1,55.41 U$2.19
D5
  Top 0.305: P1.A17 6.98,51.28 8.25,52.55 14.6,52.55 17.14,55.09 31.43,55.09 33.65,52.87 U$1.20 43.49,52.87 44.76,51.6 57.46,51.6 58.73,52.87 U$2.20
D6
  Top 0.305: P1.A16 6.98,48.74 8.25,50.01 14.6,50.01 17.14,52.55 31.11,52.55 33.33,50.33 U$1.21 43.49,50.33 44.76,49.06 57.46,49.06 58.73,50.33 U$2.21
D7
  Top 0.305: P1.A15 6.98,46.2 8.25,47.47 14.6,47.47 17.14,50.01 30.79,50.01 33.02,47.79 U$1.22 43.49,47.79 44.76,46.52 57.78,46.52 59.05,47.79 U$2.22
DACLEFT  (via drill 0.6)
  Top 0.305: v86.04,72.56 C45.+
  Bottom 0.305: v86.04,72.56 85.72,72.87 85.72,86.21 86.35,86.84 JP9.1
DACRIGHT
  Top 0.305: JP9.3 92.07,91.92 94.61,89.38 94.61,88.18 C43.+
GND  (via drill 0.6)
  Top 0.305: 22.54,43.98 22.22,43.66 | R6.1 95.56,19.53 | R5.1 95.88,35.72 | 20.31,22.07 20,21.76
  Top 0.406: 6.34,79.22 7.62,77.95 14.6,77.95 12.06,80.49 8.57,80.49 7.3,79.22 P1.A28
  Top 0.61: 20.95,43.66 20.95,39.85 19.68,38.58 IC8.9 IC8.10 18.41,35.41 18.41,34.45 20,32.87 v20,27.15 20,21.76 20,12.87 C1.- | 20.95,43.66 IC8.7 | 20.95,43.66 22.22,43.66 IC8.14 | v31.11,47.47 23.49,47.47 22.54,46.52 22.54,43.98 | P1.A28 6.34,79.22 | 14.6,77.95 15.55,77 v18.09,77 | IC1.8 v25.71,70.65 | v53.34,72.87 v56.51,72.87 C22.1 59.69,71.28 60.32,70.65 63.81,70.65 64.77,69.7 70.16,69.7 71.11,70.65 v73.02,70.65 v78.1,70.65 v86.35,70.65 93.66,70.65 97.78,66.52 107.31,66.52 108.58,67.79 111.75,67.79 IC3.7 118.74,70.01 120.01,71.28 v125.09,71.28 | C19.1 v53.34,77.64 53.34,76.36 52.7,75.73 38.73,75.73 37.78,76.68 C17.1 | 95.56,19.53 100.64,24.61 100.96,24.61 C28.1 | 95.88,35.72 C27.1 | C32.1 111.44,16.67 112.71,17.94 115.88,17.94 116.83,18.9 R10.2 116.83,26.2 111.75,31.28 C31.1 113.34,34.14 114.93,34.14 R9.2 | R6.1 88.89,19.22 87.31,20.49 69.21,20.49 68.89,20.8 v68.89,21.44 C33.- 59.37,21.44 v57.15,23.66 | v125.09,62.08 R52.2 R51.2
  Bottom 0.305: C28.1 102.55,25.88 | C27.1 103.18,42.71 | 157.16,31.16 X1.1 | v78.1,70.65 78.1,89.06 78.42,89.38 JP1.2
  Bottom 0.61: P1.C1 13.97,10.64 C1.- 15.87,8.1 17.46,1.44 | P1.C32 14.6,89.38 19.2,93.99 20.95,92.24 C9.2 | v31.11,47.47 32.06,48.43 32.06,60.49 30.16,62.4 C3.2 27.62,64.62 25.71,66.52 v25.71,70.65 26.98,71.92 32.06,71.92 33.02,72.87 C18.1 C17.1 | IC1.8 18.73,70.65 18.09,71.28 v18.09,77 18.09,81.13 17.14,82.08 17.14,83.35 | v53.34,77.64 v53.34,72.87 53.34,70.97 52.7,70.33 U$1.14 51.11,65.57 50.16,64.62 50.16,40.8 43.49,34.14 C4.2 | v78.1,70.65 U$2.14 75.24,65.57 73.02,63.35 73.02,37.95 68.89,33.82 C5.2 v68.89,21.44 | 102.55,25.88 104.13,24.29 104.13,23.03 110.8,16.36 C32.1 | 103.18,42.71 105.09,40.8 105.09,37.31 109.85,32.55 C31.1 | R10.2 119.06,20.17 122.55,16.67 R12.2 R11.2 145.41,16.67 157.16,28.42 157.16,31.16 | C2.2 116.52,70.97 115.56,70.01 IC3.7 113.98,69.7 112.71,68.43 112.71,61.76 112.07,61.12 97.15,61.12 95.88,59.86 95.88,46.2 97.47,44.62 100.96,44.62 C27.1 | v125.09,71.28 v125.09,62.08 | R51.2 153.03,62.08 157.16,66.2 157.16,69.58 X3.1 | 17.14,83.35 17.14,89.7 16.19,90.65 | IC1.3 17.14,83.35
  Bottom 0.813: 4.44,79.22 2.54,77.32 2.54,12.55 4.44,10.64 P1.A1
  Bottom 0.914: P1.A1 P1.C1 | P1.C32 P1.A32 P1.A31 P1.A30 P1.A29 P1.A28 4.44,79.22
  pour Bottom (isolate 0.61): 2.22,98.59 158.43,98.59 158.43,0.8 2.22,0.8
N$1
  Bottom 0.305: IC1.1 21.9,88.43 23.17,87.48 23.17,58.9 IC8.19
N$2  (via drill 0.6)
  Top 0.305: IC1.4 23.49,80.81 24.76,79.54 v54.92,79.54 | v56.83,50.33 U$1.8
  Bottom 0.305: v54.92,79.54 54.92,70.01 56.83,68.11 v56.83,50.33
N$3  (via drill 0.6)
  Top 0.305: IC1.5 23.17,78.27 24.44,77 30.47,77 33.02,74.46 v70.16,74.46 | v70.16,50.33 U$2.8
  Bottom 0.305: v70.16,74.46 v70.16,50.33
N$4
  Bottom 0.305: U$1.1 49.84,32.55 49.21,31.92 C8.1
N$5
  Bottom 0.305: U$1.3 54.29,37.63 54.92,37 54.92,31.28 52.7,29.06 C11.1
N$6
  Bottom 0.305: U$1.2 47.94,35.09 46.67,33.82 C8.2
N$7
  Bottom 0.305: U$1.4 54.29,40.17 55.88,38.58 55.88,27.47 C11.2
N$8
  Bottom 0.305: U$2.1 76.19,32.55 74.92,31.28 C15.1
N$9
  Bottom 0.305: U$2.3 79.69,37.63 80.32,37 80.32,31.6 78.1,29.37 C16.1
N$10
  Bottom 0.305: U$2.2 74.29,35.09 72.38,33.19 C15.2
N$11
  Bottom 0.305: U$2.4 80,40.17 81.27,38.9 81.27,27.47 C16.2
N$12  (via drill 0.6)
  Top 0.305: v42.86,45.25 U$1.23
  Bottom 0.305: v42.86,45.25 42.54,45.57 42.54,64.3 41.91,64.94 41.91,74.78 40.32,76.36 C17.2 40.32,80.49 37.78,83.03 37.78,87.48 38.73,88.43 41.59,88.43 42.22,89.06 JP6.2
N$13  (via drill 0.6)
  Top 0.305: v41.59,42.71 U$1.24 | v38.1,81.13 38.1,81.45 39.37,82.72 40.64,82.72 42.22,84.3 JP5.2
  Bottom 0.305: v41.59,42.71 41.59,63.98 40.32,65.25 C18.2 40.32,74.78 39.05,76.05 39.05,80.17 v38.1,81.13
N$14
  Bottom 0.305: U$2.23 65.08,45.25 65.08,73.83 62.23,76.68 C19.2 62.23,79.22 63.18,80.17 JP8.2
N$15  (via drill 0.6)
  Top 0.305: C22.2 63.5,72.87 65.4,70.97 v66.35,70.97
  Bottom 0.305: U$2.24 65.4,42.71 66.03,43.34 66.03,70.65 v66.35,70.97 | JP7.2 63.18,88.75 61.91,87.48 61.91,81.13 60.96,80.17 60.96,74.14 C22.2
N$16  (via drill 0.6)
  Top 0.305: v66.67,38.9 45.08,38.9 43.81,37.63 U$1.26 | C10.- 68.26,86.53 v67.94,86.84
  Bottom 0.305: v66.67,38.9 67.62,39.85 67.62,75.41 68.57,76.36 68.57,86.21 v67.94,86.84
N$17
  Bottom 0.305: JP5.1 44.76,79.54 45.4,78.9 45.4,74.14 R2.1
N$18
  Bottom 0.305: JP6.1 44.76,89.7 43.81,88.75 43.81,88.43 43.49,88.11 43.49,78.27 R1.1
N$19
  Top 0.305: JP3.2 93.66,24.93 R6.2
N$20
  Top 0.305: JP2.2 92.39,41.44 94.29,43.34 R5.2
N$21  (via drill 0.6)
  Top 0.305: v68.89,37.63 U$2.26
  Bottom 0.305: v68.89,37.63 68.89,75.41 69.53,76.05 69.53,90.34 71.11,91.92 C6.-
N$22  (via drill 0.6)
  Top 0.305: R12.1 124.45,25.25 124.45,30.96 128.01,34.52 C23.- 137.16,35.09 v140.65,31.6
  Bottom 0.305: v140.65,31.6 140.65,31.28 145.73,26.2 149.45,26.2 X1.3
N$23  (via drill 0.6)
  Top 0.305: R11.1 128.58,26.83 128.01,27.41 C24.- 140.97,29.69 v142.87,31.6
  Bottom 0.305: v142.87,31.6 149.75,31.6 X1.2
N$24
  Bottom 0.305: C29.1 107.31,25.88 109.21,23.98 109.21,22.07 | 109.21,22.07 R10.1 | 113.02,22.39 113.98,23.34 T2.1 113.98,24.93 119.38,30.33 JP4.1 | 113.02,22.39 112.71,22.07 109.21,22.07 | C32.2 113.98,21.44 113.02,22.39
N$25
  Bottom 0.305: C30.1 108.9,40.8 108.9,39.22 109.53,38.58 | 109.53,38.58 R9.1 | T1.1 114.61,38.58 | 114.61,38.58 114.61,32.87 | 114.61,32.87 C31.2 | 109.53,38.58 114.61,38.58 | 114.61,32.87 116.83,32.87 119.38,35.41 JP4.3 125.66,35.41 C23.+
N$26
  Top 0.305: R7.1 98.74,36.04 C27.2 C30.2 108.9,40.17 111.12,42.39 T1.2
N$27
  Top 0.813: U$3.3 57.46,8.1 58.73,6.83 64.13,6.83 65.08,5.88 C36.1
N$28
  Top 0.305: R8.1 98.74,19.85 C28.2 C29.2 109.85,23.34 109.85,23.03 112.39,23.03 112.71,23.34 T2.2
N$29
  Bottom 0.813: R13.2 43.18,5.88 46.98,9.69 R16.1 49.53,9.69 52.07,12.23 56.83,12.23 60,15.4 U$3.5
N$30
  Bottom 0.305: JP4.2 122.8,32.87 C24.+
N$31
  Top 0.813: L4.1 16.82,21.76 13.65,18.58 13.65,6.51 14.92,5.25 D2.A 22.22,7.79 50.8,7.79 52.07,9.05 U$3.1
N$32
  Top 0.813: D2.C 35.87,4.29 L2.1 56.51,4.29 58.1,2.71 69.21,2.71 71.75,5.25 71.75,6.2 C35.+
  Bottom 0.813: D2.C 34.92,5.88 38.73,9.69 R16.2
N$33
  Bottom 0.813: L4.2 39.37,21.76 41.59,19.53 | 41.59,19.53 R15.2 41.59,13.82 R14.2 | U$3.7 54.92,18.26 53.65,19.53 41.59,19.53
N$34
  Bottom 0.813: R15.1 52.07,16.99 U$3.8
N$35
  Bottom 0.61: IC1.13 IC1.14 | IC1.14 IC1.15 | IC1.14 32.38,83.35 R17.1
N$36  (via drill 0.6)
  Top 0.305: v64.13,76.36 65.08,75.41 71.75,75.41 R4.2
  Bottom 0.305: JP7.1 65.72,88.75 64.45,87.48 64.45,76.68 v64.13,76.36
N$37  (via drill 0.6)
  Top 0.305: v65.72,79.22 72.07,79.22 R3.2
  Bottom 0.305: JP8.1 v65.72,79.22
N$38
  Top 0.305: C6.+ JP1.3
N$39
  Top 0.305: C10.+ 76.83,86.53 77.15,86.84 JP1.1
N$57  (via drill 0.6)
  Top 0.305: R36.1 v112.07,91.92
  Bottom 0.305: v112.07,91.92 112.07,87.16 IC3.1
N$58
  Top 0.305: C43.- R35.2
N$59  (via drill 0.6)
  Top 0.305: v109.53,72.56 IC3.6
  Bottom 0.305: R35.1 109.53,88.11 | 109.53,88.11 v109.53,72.56 | R37.2 112.39,96.69 109.53,93.83 109.53,88.11
N$60  (via drill 0.6)
  Top 0.305: IC3.5 117.15,75.09 v119.38,77.32 | v119.38,83.98 124.14,83.98 R38.2
  Bottom 0.305: v119.38,77.32 v119.38,83.98 | R37.1 126.04,92.24 R38.2
N$61
  Top 0.305: R40.1 108.26,84.3 109.85,82.72 IC3.2
N$62
  Top 0.305: C44.- R39.2
N$63
  Top 0.305: R39.1 109.85,80.49 110.17,80.17 IC3.3
  Bottom 0.305: R41.2 111.44,93.51 110.8,92.87 110.8,81.45 112.07,80.17 IC3.3
N$64
  Top 0.305: IC3.4 117.15,77.64 118.42,78.9 122.87,78.9 R42.2
  Bottom 0.305: R41.1 122.87,93.51 123.82,92.56 123.82,84.3 R42.2
N$65
  Top 0.305: R44.1 109.53,76.36 112.07,78.9 115.88,78.9 116.52,79.54 116.52,80.81 118.42,82.72 IC3.13
N$66
  Top 0.305: C45.- R43.2
N$67  (via drill 0.6)
  Top 0.305: R43.1 107.63,72.56 v109.53,70.65 | v109.53,66.52 R45.2 117.47,66.52 118.74,67.79 119.38,67.79 IC3.8
  Bottom 0.305: v109.53,70.65 v109.53,66.52
N$68
  Bottom 0.305: IC3.9 122.87,72.56 | 122.87,72.56 123.82,71.6 123.82,68.75 R45.1 | R46.2 125.72,78.27 124.14,76.68 124.14,73.83 122.87,72.56
N$69  (via drill 0.6)
  Top 0.305: R48.1 109.53,68.75 112.07,71.28 v118.1,71.28 | v118.1,80.17 IC3.12
  Bottom 0.305: v118.1,71.28 v118.1,80.17
N$70
  Top 0.305: C46.- 99.37,64.94 R47.2
N$71  (via drill 0.6)
  Top 0.305: R47.1 110.17,64.62 110.8,63.98 | 110.8,63.98 111.44,63.35 R49.2 | IC3.11 121.28,77.64 117.47,73.83 v111.44,73.83 | v111.44,64.62 110.8,63.98
  Bottom 0.305: v111.44,73.83 v111.44,64.62
N$72
  Top 0.305: IC3.10 125.41,75.09 R50.2
  Bottom 0.305: IC3.10 120.96,75.09 119.38,73.51 119.38,64.3 120.33,63.35 R49.1
N$73
  Bottom 0.305: R42.1 R38.1 135.19,85.89 C47.+
N$74
  Bottom 0.305: C47.- 139.12,80.43 141.28,78.27 141.28,64.94 | 141.28,64.94 141.28,64.62 149.45,64.62 X3.3 | R52.1 135.88,69.06 140.33,64.62 140.97,64.62 141.28,64.94
N$75
  Bottom 0.305: R50.1 R46.1 135.19,78.27 C48.+
N$76  (via drill 0.6)
  Top 0.305: R51.1 v143.19,69.7
  Bottom 0.305: C48.- 139.12,70.27 R51.1 | v143.19,69.7 149.43,69.7 X3.2
PHI2  (via drill 0.6)
  Top 0.305: P1.C26 16.82,74.14 19.04,71.92 32.06,71.92 33.65,70.33 45.08,70.33 46.35,69.06 v48.26,69.06 | v48.26,45.25 U$1.6 57.78,45.25 59.05,46.52 68.26,46.52 69.53,45.25 U$2.6
  Bottom 0.305: v48.26,69.06 v48.26,45.25
R/-W  (via drill 0.6)
  Top 0.305: P1.C25 16.5,71.6 18.73,69.38 44.13,69.38 45.4,68.11 v54.92,68.11 | U$1.7 v54.92,47.79 57.78,47.79 59.05,49.06 68.57,49.06 69.84,47.79 U$2.7
  Bottom 0.305: v54.92,68.11 v54.92,47.79
SIDLEFT
  Top 0.305: U$1.27 44.13,35.09 45.4,36.36 83.81,36.36 86.35,38.9 JP2.1 94.61,38.9 96.83,41.12 96.83,41.44 R7.2
  Bottom 0.305: C46.+ 94.55,46.27 97.47,43.34 R7.2
SIDRIGHT  (via drill 0.6)
  Top 0.305: U$2.27 71.11,35.09 72.38,33.82 v84.13,33.82 | JP3.1 94.29,22.39 R8.2 | v84.13,80.49 C44.+
  Bottom 0.305: JP3.1 88.26,22.39 86.67,23.98 86.67,31.28 v84.13,33.82 v84.13,80.49
VCC  (via drill 0.6)
  Top 0.305: 51.75,81.76 v51.75,81.45 52.07,81.76 | 119.06,90.34 C2.1 | JP5.3 JP6.3 39.68,88.75 39.37,88.43 | JP7.3 JP8.3 60.64,81.76 | v66.99,80.49 66.99,81.76
  Top 0.508: 8.89,44.93 v14.6,44.93 | 8.25,19.53 3.17,19.53 2.54,20.17
  Top 0.61: P1.C3 10.16,15.72 | 8.25,19.53 8.25,44.3 8.89,44.93 | 2.54,20.17 2.54,89.38 4.44,91.29 17.77,91.29 20.63,94.14 26.03,94.14 27.3,92.87 C9.1 | IC8.12 v32.7,38.58 33.02,40.17 U$1.25 43.18,40.17 44.45,41.44 58.1,41.44 59.37,40.17 U$2.25 | IC8.12 27.62,38.58 28.89,39.85 28.89,45.25 27.93,46.2 IC8.15 | IC1.16 39.37,88.43 45.08,88.43 51.75,81.76 | 58.1,81.76 60.64,81.76 66.99,81.76 v73.97,81.76 86.67,81.76 91.12,86.21 100.32,86.21 104.77,90.65 113.66,90.65 114.3,91.29 118.1,91.29 119.06,90.34 | 58.1,81.76 52.07,81.76 | IC8.12 25.71,38.58 23.81,36.68 v23.81,26.2 | v30.79,53.82 IC8.18 | 66.42,22.77 v66.35,22.71 | v58.1,80.81 58.1,81.76
  Top 0.813: 66.42,22.77 65.65,22.77 63.81,23.98 C33.+
  Top 0.914: 10.16,15.72 8.25,17.63 8.25,19.53
  Bottom 0.305: R4.1 R3.1 66.35,78.27 66.99,78.9 v66.99,80.49
  Bottom 0.61: IC8.2 IC8.3 IC8.18 28.25,53.82 29.2,52.87 29.2,49.38 28.57,48.74 IC8.16 | v14.6,44.93 24.12,44.93 25.39,46.2 IC8.15 IC8.16 | IC8.5 IC8.16 | IC1.16 27.62,89.06 27.62,90.34 27.3,90.65 C9.1 28.25,91.29 R17.2 | v51.75,81.45 R1.2 R2.2 | C2.1 119.06,86.21 120.01,85.25 IC3.14 | C3.1 25.08,60.49 IC8.20 30.16,58.9 30.79,58.27 v30.79,53.82 | v66.35,22.71 C5.1 66.35,35.41 | 66.35,35.41 66.35,35.72 65.4,36.68 65.4,39.22 64.45,40.17 U$2.25 61.59,40.17 59.69,42.08 59.69,69.06 58.1,70.65 v58.1,80.81 | C4.1 40.95,36.68 U$1.25 | 66.35,35.41 68.89,35.41 71.75,38.26 71.75,64.3 75.88,68.43 75.88,78.27 73.97,80.17 v73.97,81.76
  Bottom 0.813: v32.7,38.58 32.7,27.15 32.7,24.29 | R14.1 49.84,13.5 50.8,14.45 56.51,14.45 57.46,15.4 U$3.6 57.46,20.49 60.96,23.98 C33.+ 61.27,24.29 58.41,21.44 41.91,21.44 39.05,24.29 32.7,24.29 | C7.1 67.3,17.94 66.35,18.9 v66.35,22.71 | C1.+ 15.87,16.36 23.81,24.29 | 23.81,24.29 32.7,24.29 | v23.81,26.2 23.81,24.29
  Bottom 0.914: P1.C3 P1.C2 13.97,13.18 C1.+
VDD  (via drill 0.6)
  Top 0.305: 104.45,30.96 104.77,30.96
  Top 0.61: U$1.28 44.45,32.55 45.72,33.82 57.78,33.82 59.05,32.55 U$2.28 73.02,32.55 74.61,30.96 104.45,30.96 104.45,33.5 111.44,40.49 T1.3 | 104.77,30.96 T2.3
  Top 0.813: C34.+ v65.4,16.99
  Bottom 0.813: L2.2 62.23,4.29 64.13,6.2 64.13,16.99 | 64.13,16.99 64.13,31.28 U$2.28 | v65.4,16.99 64.13,16.99

### Text on the board
Top: CSA-DUALSID-1.0B | (C) A. Fachat
tPlace: SID EXTIN / mixer input | Board mixer / input
tNames: CSA-DUALSID-1.0B | (C) A. Fachat